# EasyEDA schematic SCH_555-circuit_2025-03-19.json
TITLE: Sheet_1; REV: 1.0; Date: 2025-03-10; Sheet: 1/1; Drawn By: evrenpmccarthy; Company: Your Company
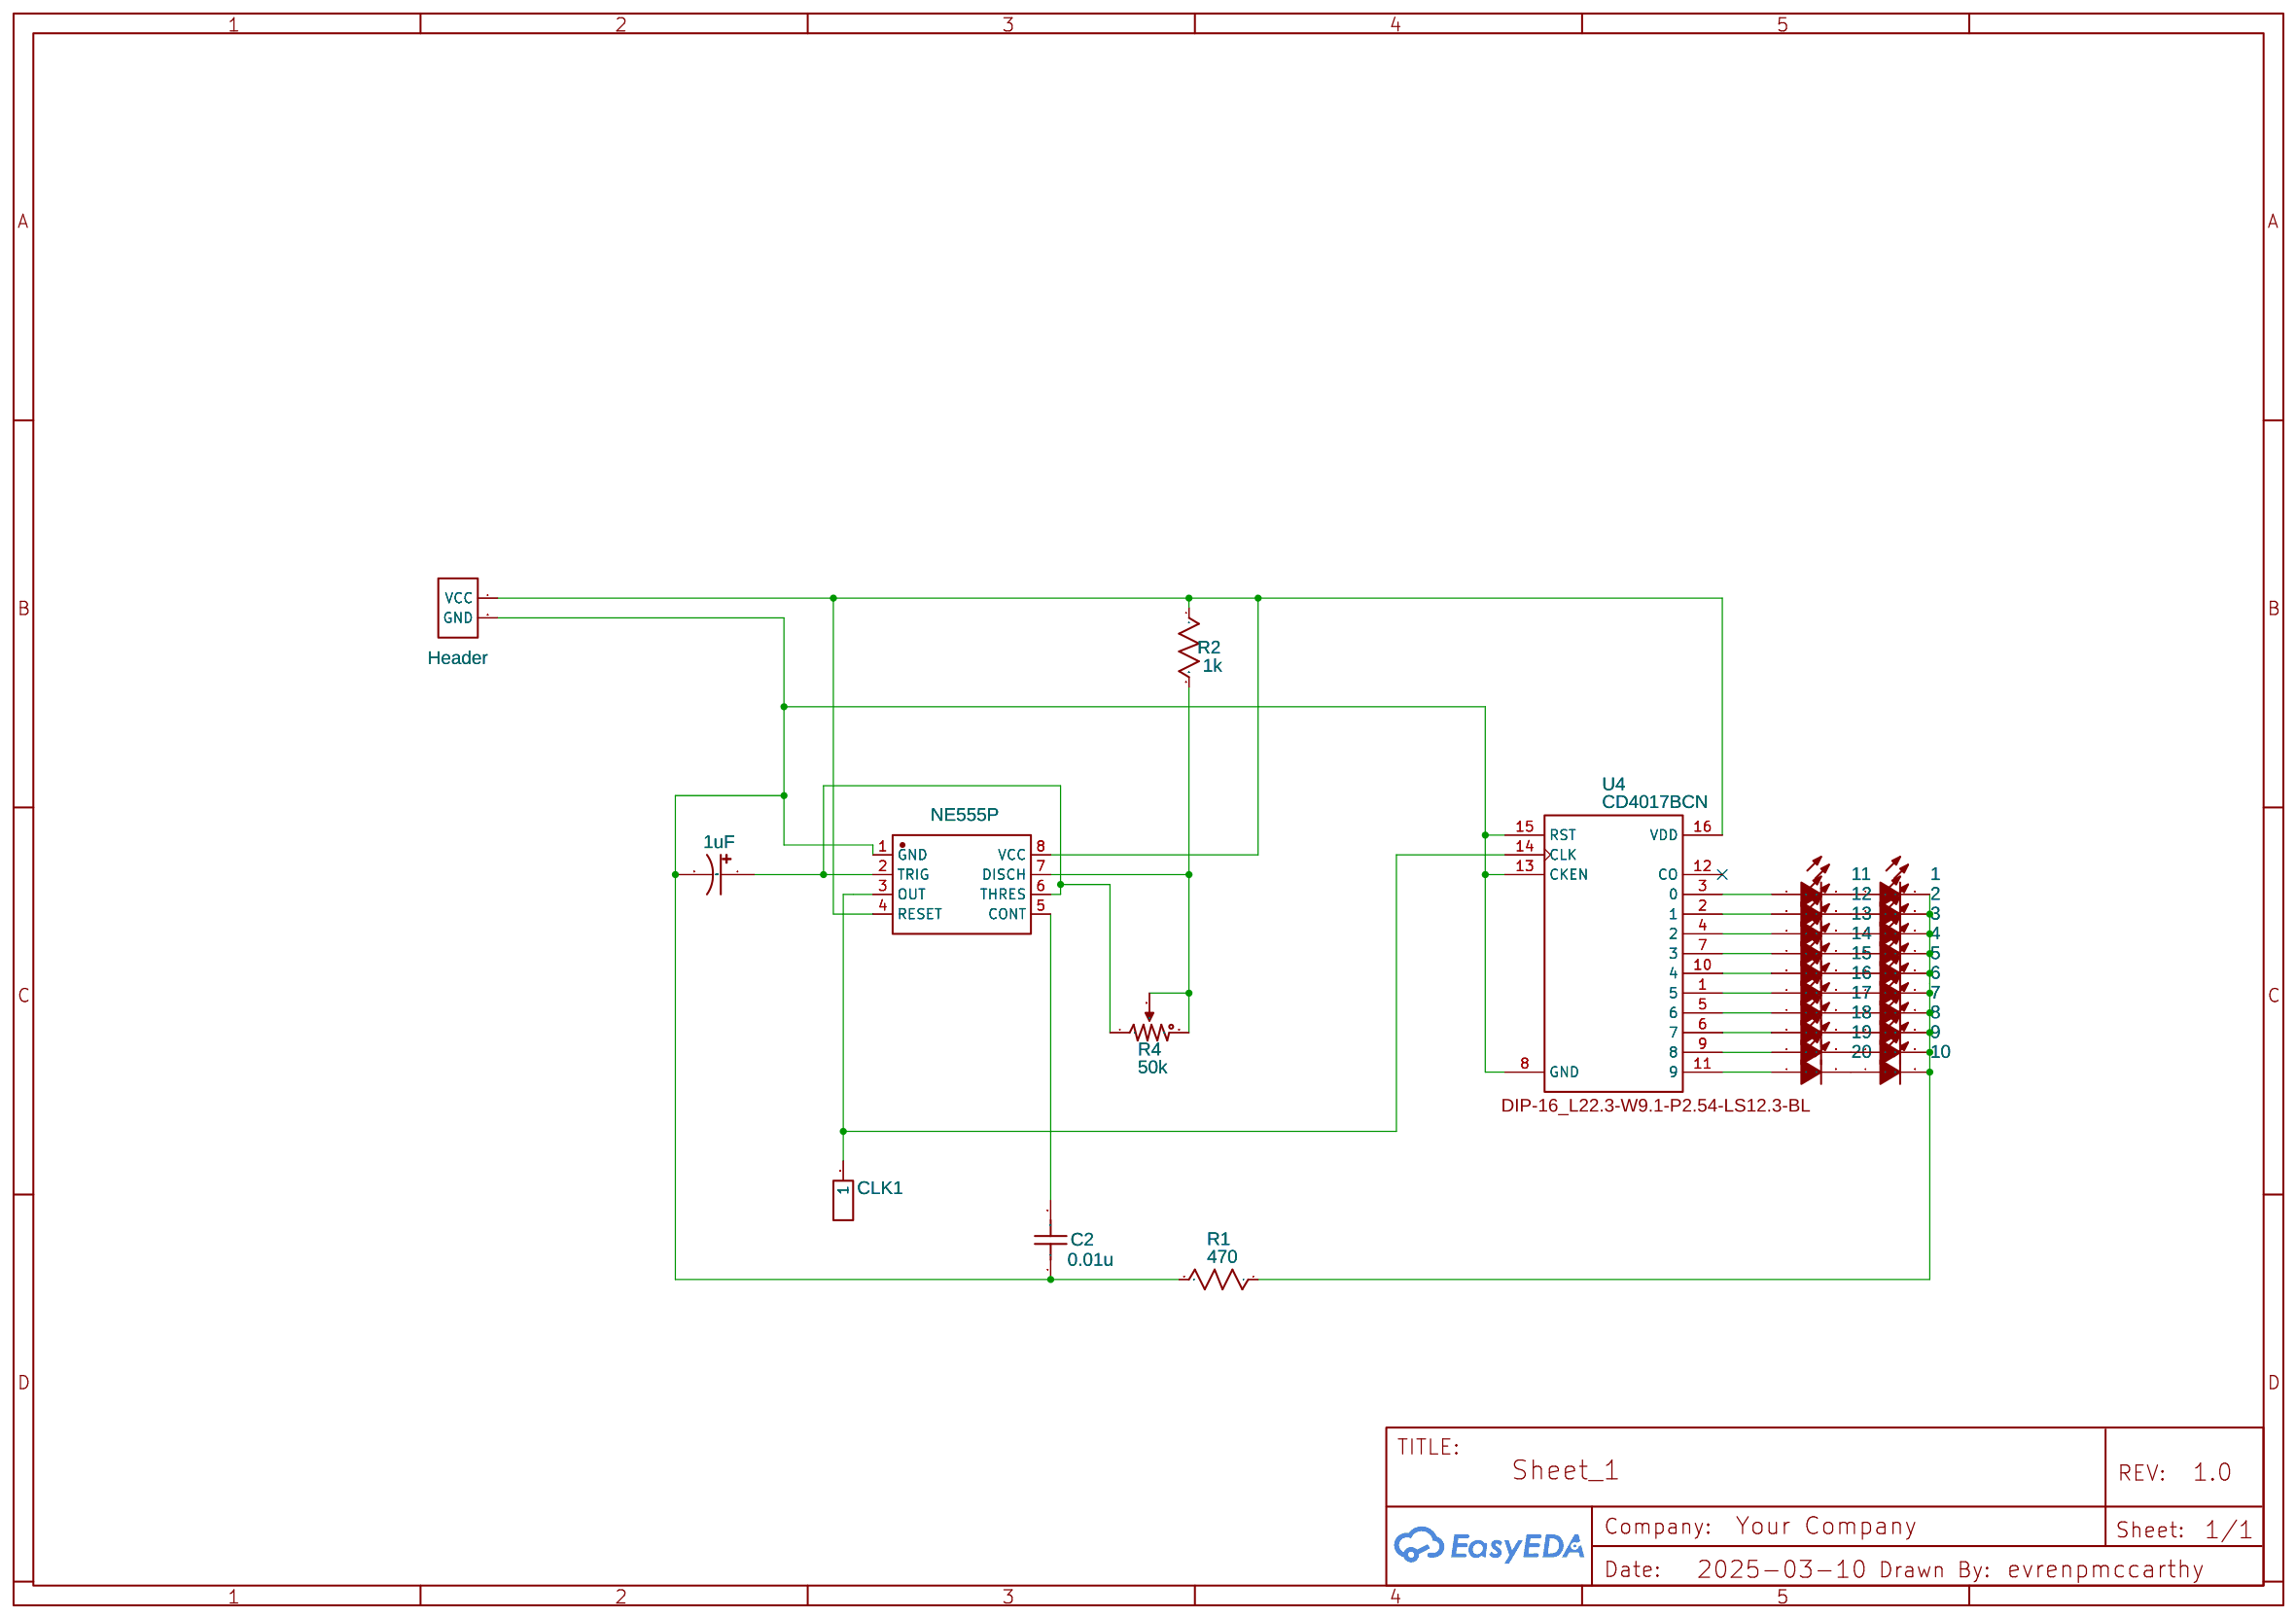
[diagram p0: schematic sheet]

## Parts
1  LED_5MM  [LED-TH_BD5.0-P2.54-FD_C9900023552]
2  LED_5MM  [LED-TH_BD5.0-P2.54-FD_C9900023552]
3  LED_5MM  [LED-TH_BD5.0-P2.54-FD_C9900023552]
4  LED_5MM  [LED-TH_BD5.0-P2.54-FD_C9900023552]
5  LED_5MM  [LED-TH_BD5.0-P2.54-FD_C9900023552]
6  LED_5MM  [LED-TH_BD5.0-P2.54-FD_C9900023552]
7  LED_5MM  [LED-TH_BD5.0-P2.54-FD_C9900023552]
8  LED_5MM  [LED-TH_BD5.0-P2.54-FD_C9900023552]
9  LED_5MM  [LED-TH_BD5.0-P2.54-FD_C9900023552]
10  LED_5MM  [LED-TH_BD5.0-P2.54-FD_C9900023552]
11  LED_5MM  [LED-TH_BD5.0-P2.54-FD_C9900023552]
12  LED_5MM  [LED-TH_BD5.0-P2.54-FD_C9900023552]
13  LED_5MM  [LED-TH_BD5.0-P2.54-FD_C9900023552]
14  LED_5MM  [LED-TH_BD5.0-P2.54-FD_C9900023552]
15  LED_5MM  [LED-TH_BD5.0-P2.54-FD_C9900023552]
16  LED_5MM  [LED-TH_BD5.0-P2.54-FD_C9900023552]
17  LED_5MM  [LED-TH_BD5.0-P2.54-FD_C9900023552]
18  LED_5MM  [LED-TH_BD5.0-P2.54-FD_C9900023552]
19  LED_5MM  [LED-TH_BD5.0-P2.54-FD_C9900023552]
20  LED_5MM  [LED-TH_BD5.0-P2.54-FD_C9900023552]
C1  1uF  [CAP-TH_BD5.0-P2.00-D0.8-FD]
C2  0.01u  [C0603]
CLK1  C81276  [HDR-TH_1P-P2.54-V-M]
H1  Header  [HDR-M-2.54_1X2]
R1  470  [R_AXIAL-0.3]
R2  1k  [R_AXIAL-0.3]
R4  50k  [RES-ADJ-3296X]
U2  NE555P  [DIP-8_L9.8-W6.6-P2.54-LS7.6-BL]
U4  CD4017BCN  [DIP-16_L22.3-W9.1-P2.54-LS12.3-BL]

## Library data of the parts
1-20 = LED_5MM: Contributor: lcsc; Supplier: LCSC; Supplier Part: C779445
C1 = UVZ1H010MDD: Contributor: LCSC; Supplier: LCSC; Supplier Part: C62934; Manufacturer: Nichicon(尼吉康)
C2 = C_0603_US: Supplier Part: C6204607; Supplier: LCSC; Contributor: LCEDA_Lib
CLK1 = Header-Male-2.54_1x1: Supplier: LCSC; Manufacturer Part: 2.54-1*1P针; JLCPCB Part Class: Extended Part; Package Display: No; Manufacturer: BOOMELE(Boom Precision Elec); Contributor: Thejo Prakash
H1 = HEADER-FEMALE-2.54_1X2: Contributor: nonstop2004; Supplier: LCSC; Supplier Part: C492401; Package Display: No
R1 = Resistor: Manufacturer Part: ?; Supplier Part: C58592; Supplier: LCSC
R2 = Resistor: Manufacturer Part: ?; Supplier Part: C713997; Supplier: LCSC
R4 = Potentiometer: K(%): 50; Manufacturer Part: ?; Supplier: LCSC; Supplier Part: C118912; Package Display: No
U2 = NE555P: Supplier: LCSC; Manufacturer: TI(德州仪器); Supplier Part: C46749; JLCPCB Part Class: Extended Part
U4 = CD4017BCN: Decade CounterDivider with 10 Decoded Outputs; Supplier: LCSC; Supplier Part: C32710674; Package Display: Yes

## Nets
Net-(1-1): 1.1(A) 11.2(K)
Net-(1-2): 1.2(K) 2.2(K) 3.2(K) 4.2(K) 5.2(K) 6.2(K) 7.2(K) 8.2(K) 9.2(K) 10.2(K) R1.1
Net-(2-1): 2.1(A) 12.2(K)
Net-(3-1): 3.1(A) 13.2(K)
Net-(4-1): 4.1(A) 14.2(K)
Net-(5-1): 5.1(A) 15.2(K)
Net-(6-1): 6.1(A) 16.2(K)
Net-(7-1): 7.1(A) 17.2(K)
Net-(8-1): 8.1(A) 18.2(K)
Net-(9-1): 9.1(A) 19.2(K)
Net-(10-1): 10.1(A) 20.2(K)
Net-(11-1): 11.1(A) U4.3(0)
Net-(12-1): 12.1(A) U4.2(1)
Net-(13-1): 13.1(A) U4.4(2)
Net-(14-1): 14.1(A) U4.7(3)
Net-(15-1): 15.1(A) U4.10(4)
Net-(16-1): 16.1(A) U4.1(5)
Net-(17-1): 17.1(A) U4.5(6)
Net-(18-1): 18.1(A) U4.6(7)
Net-(19-1): 19.1(A) U4.9(8)
Net-(20-1): 20.1(A) U4.11(9)
Net-(C1-1): C1.1 R4.1 U2.2(TRIG) U2.6(THRES)
Net-(C1-2): C1.2 C2.1 H1.2(GND) R1.2 U2.1(GND) U4.8(GND) U4.13(CKEN) U4.15(RST)
Net-(C2-2): C2.2 U2.5(CONT)
Net-(CLK1-1): CLK1.1 U2.3(OUT) U4.14(CLK)
Net-(H1-1): H1.1(VCC) R2.1 U2.4(RESET) U2.8(VCC) U4.16(VDD)
Net-(R2-2): R2.2 R4.2(3) R4.3(2) U2.7(DISCH)

Not connected (* = marked no-connect by the designer): U4 12(CO)*
